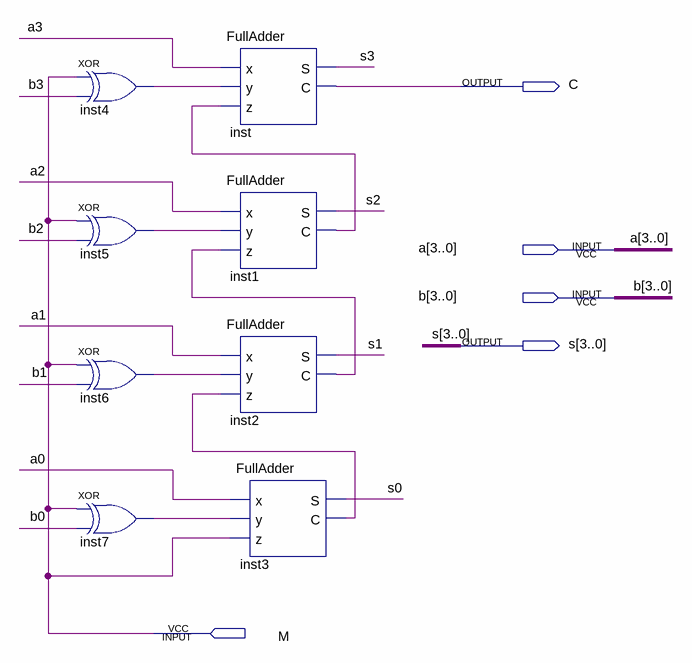
[diagram p0: schematic sheet]
// Quartus schematic nBitAddSub.bdf as structural Verilog: 8 symbols, 5 pins
module nBitAddSub (
  input  [3:0] a,
  input  [3:0] b,
  input  M,
  output C,
  output [3:0] s
);

  wire inst1_c, inst2_c, inst3_c, inst4_out, inst5_out, inst6_out, inst7_out;

  xor inst4 (inst4_out, M, b[3]);
  xor inst5 (inst5_out, M, b[2]);
  xor inst6 (inst6_out, M, b[1]);
  xor inst7 (inst7_out, M, b[0]);
  FullAdder inst (.x(a[3]), .y(inst4_out), .z(inst1_c), .S(s[3]), .C(C));
  FullAdder inst1 (.x(a[2]), .y(inst5_out), .z(inst2_c), .S(s[2]), .C(inst1_c));
  FullAdder inst2 (.x(a[1]), .y(inst6_out), .z(inst3_c), .S(s[1]), .C(inst2_c));
  FullAdder inst3 (.x(a[0]), .y(inst7_out), .z(M), .S(s[0]), .C(inst3_c));
endmodule
